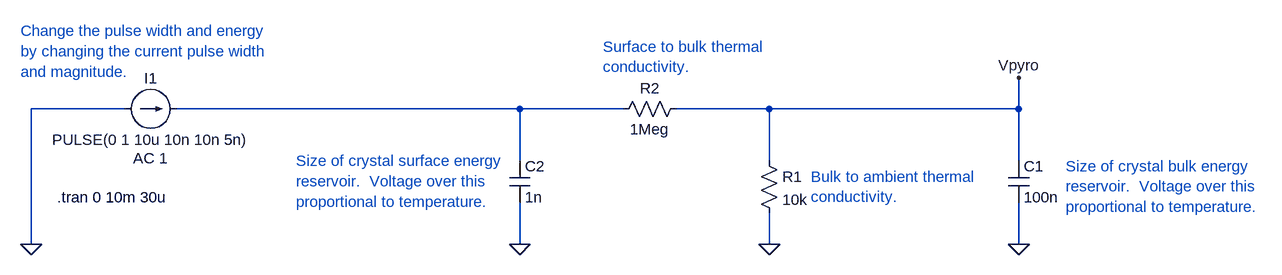
[diagram p0: schematic pyro_pulse_model.asc]
pyro_pulse_model.asc, the LTspice schematic file:
Version 4
SHEET 1 1168 680
WIRE -688 160 -832 160
WIRE -80 160 -608 160
WIRE 80 160 -80 160
WIRE 304 160 160 160
WIRE 688 160 688 112
WIRE 688 160 304 160
WIRE -80 240 -80 160
WIRE 304 240 304 160
WIRE 688 240 688 160
WIRE -832 368 -832 160
WIRE -80 368 -80 304
WIRE 304 368 304 320
WIRE 688 368 688 304
FLAG -832 368 0
FLAG 688 368 0
FLAG 304 368 0
FLAG -80 368 0
FLAG 688 112 Vpyro
SYMBOL current -688 160 R270
WINDOW 0 32 40 VTop 0
WINDOW 3 -32 40 VBottom 0
WINDOW 123 -60 40 VBottom 0
WINDOW 39 0 0 Left 0
SYMATTR InstName I1
SYMATTR Value PULSE(0 1 10u 10n 10n 5n)
SYMATTR Value2 AC 1
SYMBOL cap 672 240 R0
SYMATTR InstName C1
SYMATTR Value 100n
SYMBOL res 288 224 R0
SYMATTR InstName R1
SYMATTR Value 10k
SYMBOL cap -96 240 R0
SYMATTR InstName C2
SYMATTR Value 1n
SYMBOL res 64 176 R270
WINDOW 0 32 56 VTop 0
WINDOW 3 0 56 VBottom 0
SYMATTR InstName R2
SYMATTR Value 1Meg
TEXT -792 296 Left 0 !.tran 0 10m 30u
TEXT -848 40 Left 0 ;Change the pulse width and energy\nby changing the current pulse width\nand magnitude.
TEXT -424 240 Left 0 ;Size of crystal surface energy\nreservoir.  Voltage over this\nproportional to temperature.
TEXT 48 64 Left 0 ;Surface to bulk thermal\nconductivity.
TEXT 368 264 Left 0 ;Bulk to ambient thermal\nconductivity.
TEXT 760 248 Left 0 ;Size of crystal bulk energy\nreservoir.  Voltage over this \nproportional to temperature.

The netlist it stands for:
* pyro_pulse_model.asc
I1 0 N001 PULSE(0 1 10u 10n 10n 5n) AC 1
C1 Vpyro 0 100n
R1 Vpyro 0 10k
C2 N001 0 1n
R2 N001 Vpyro 1Meg
.tran 0 10m 30u
* Change the pulse width and energy
* by changing the current pulse width
* and magnitude.
* Size of crystal surface energy
* reservoir.  Voltage over this
* proportional to temperature.
* Surface to bulk thermal
* conductivity.
* Bulk to ambient thermal
* conductivity.
* Size of crystal bulk energy
* reservoir.  Voltage over this
* proportional to temperature.
.backanno
.end